# EAGLE schematic PianoBoard (EAGLE 9.6.2)
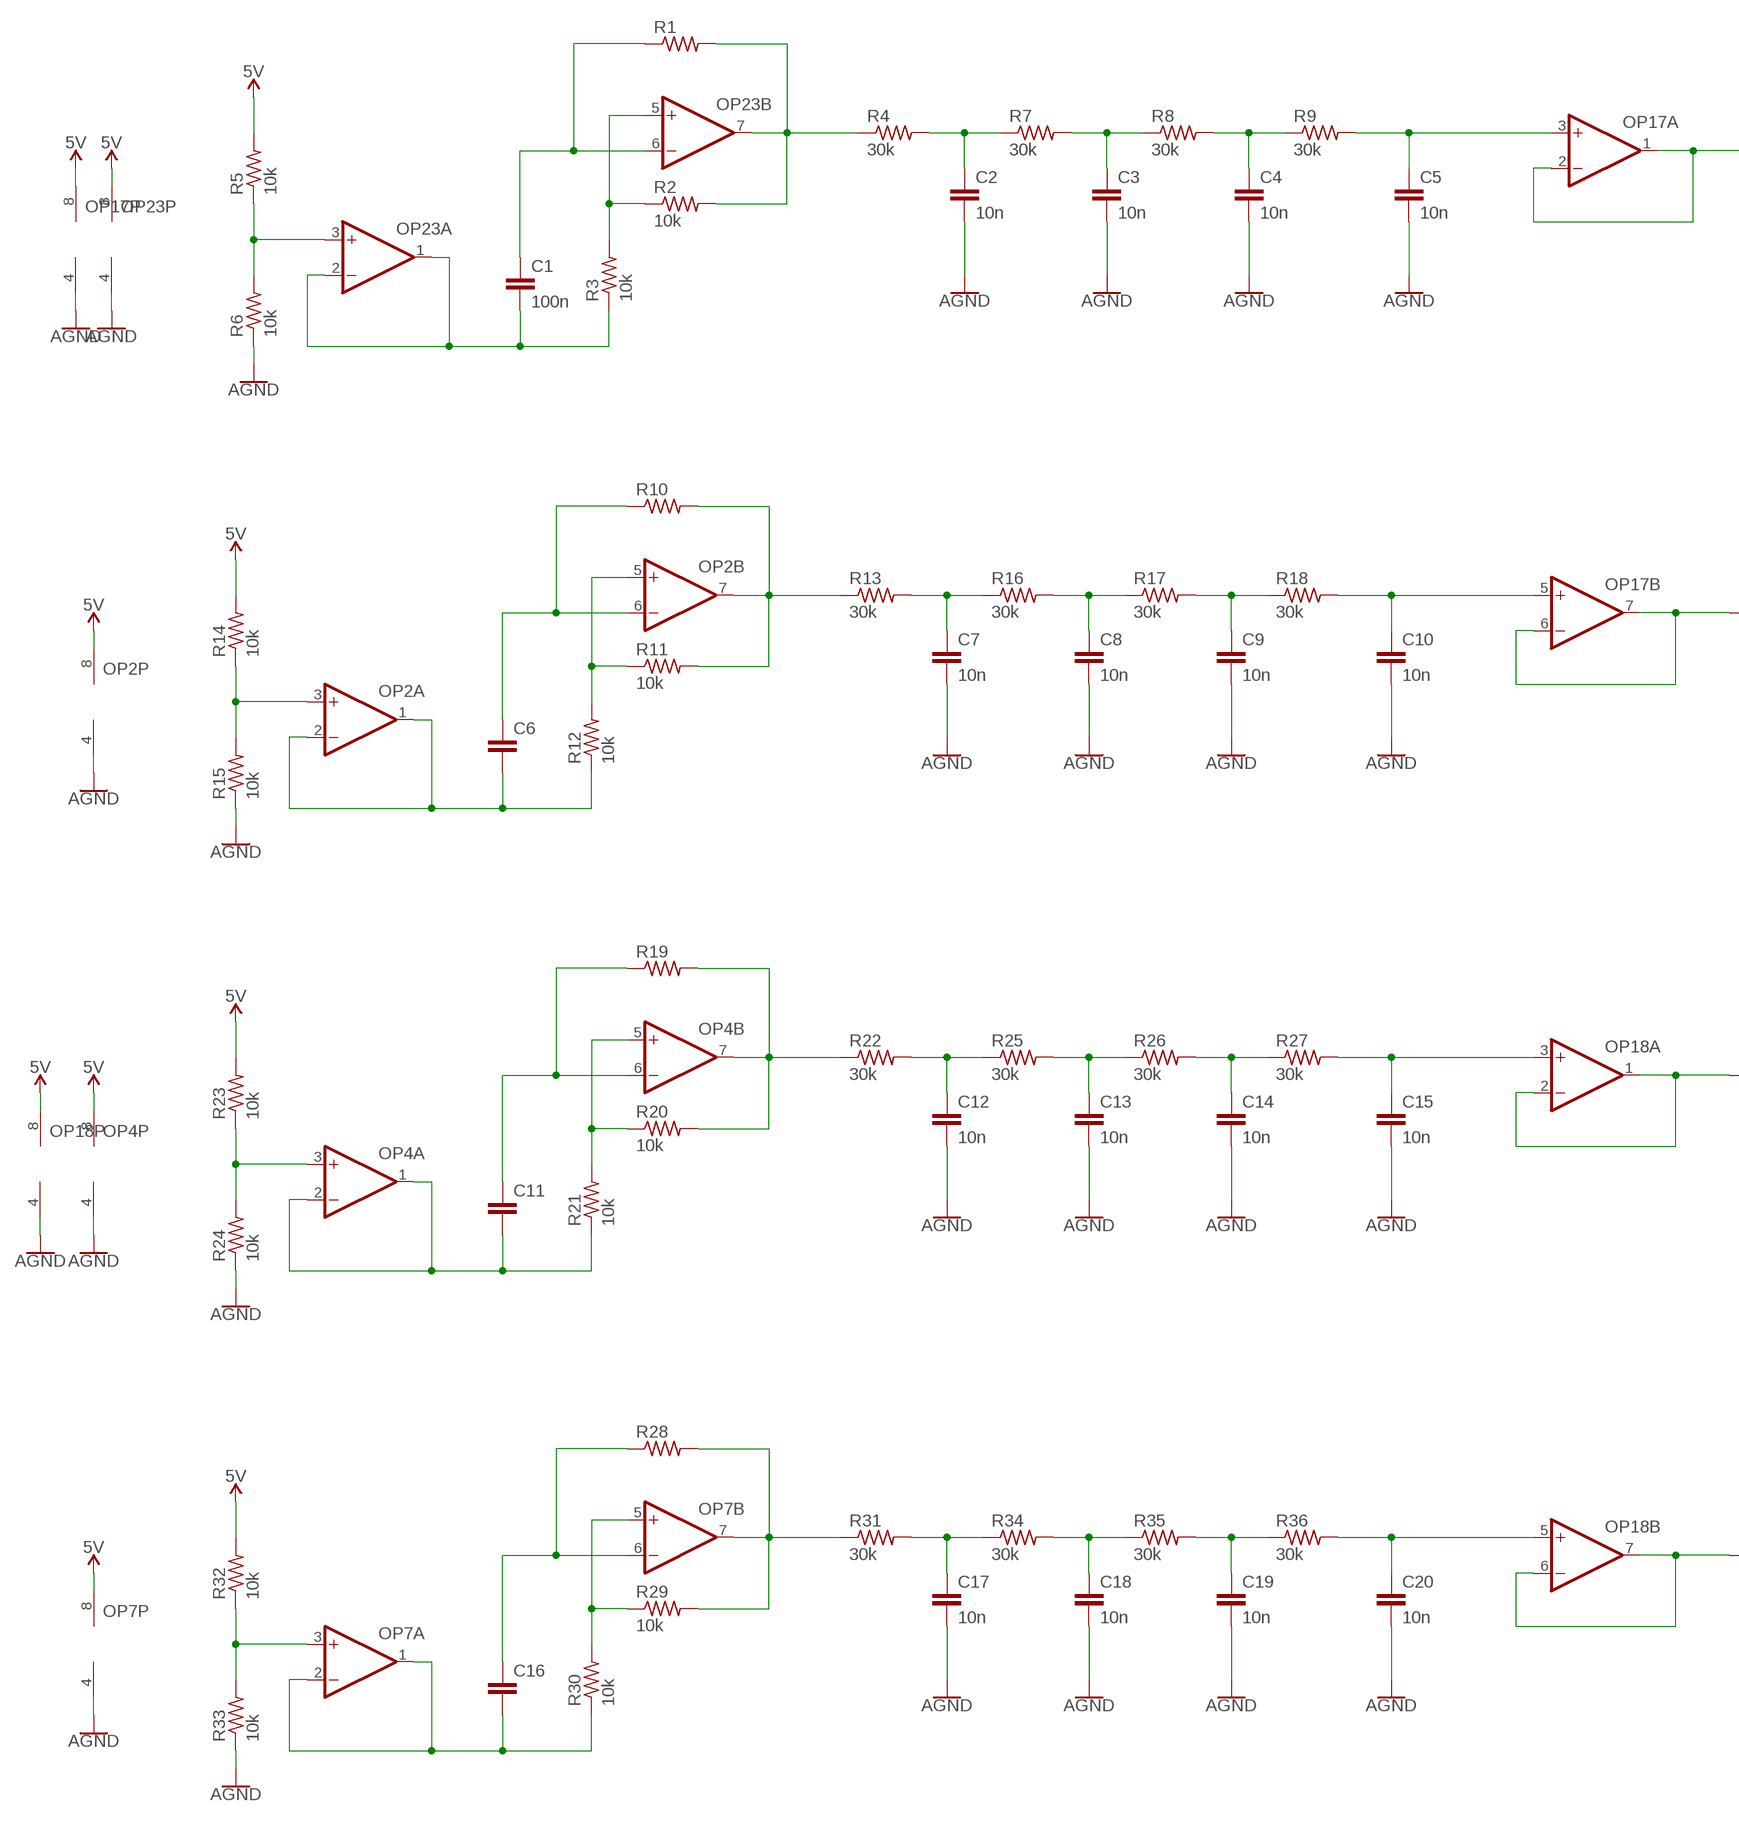
[diagram p0: schematic, sheet 1, part 1 of 2]
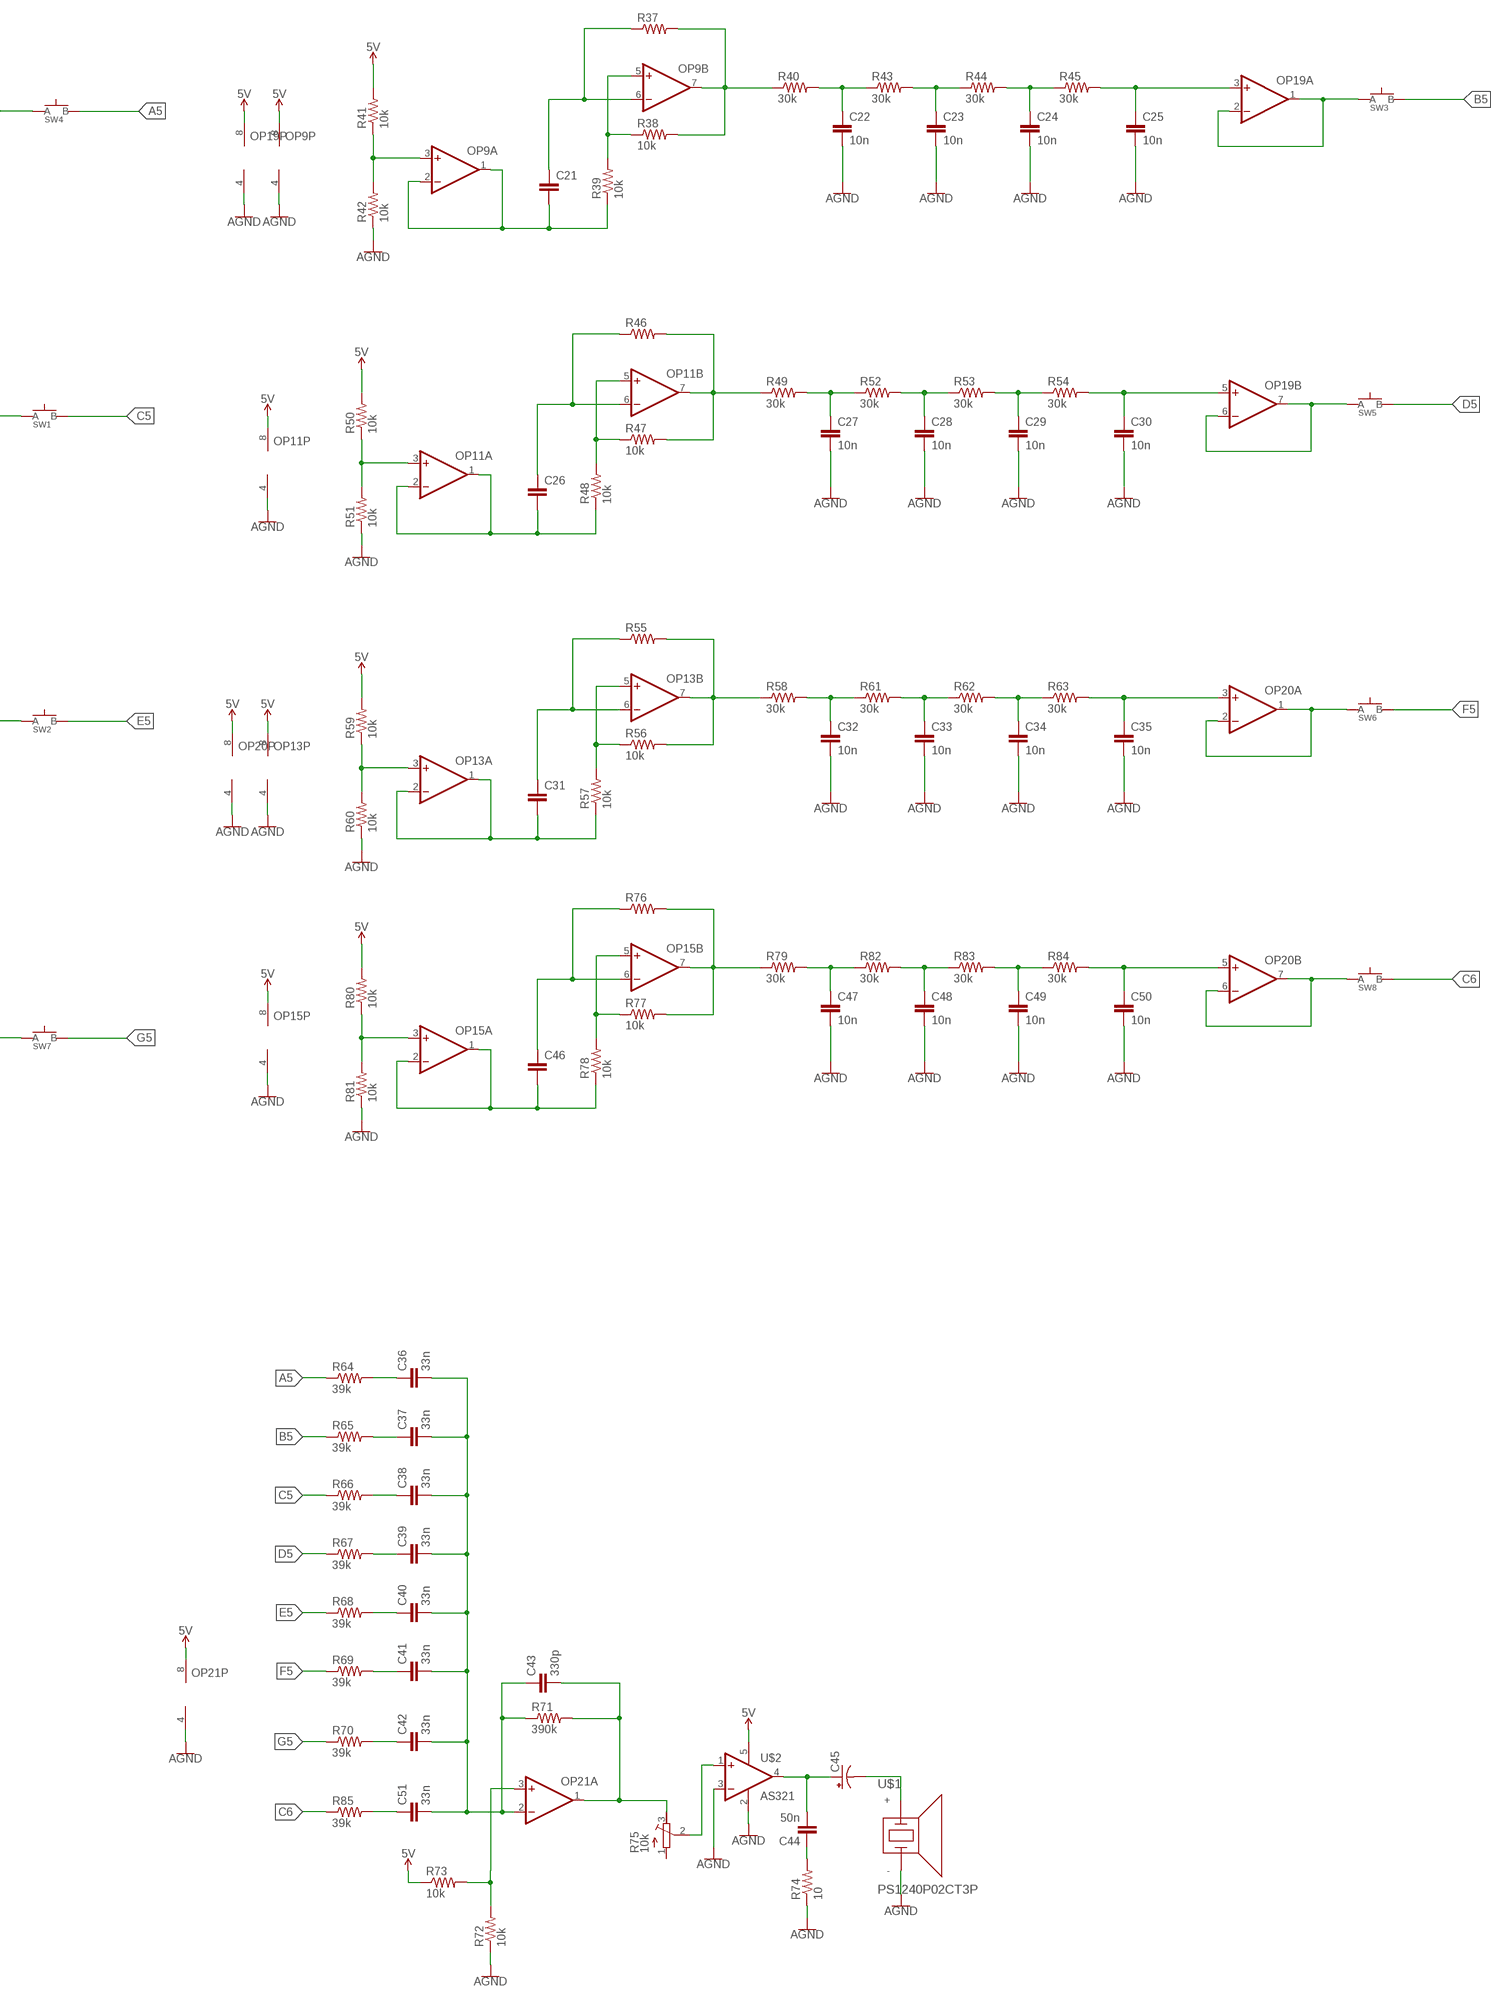
[diagram p1: schematic, sheet 1, part 2 of 2]

## Parts
C1  100n  CAPACITOR0603  [C0603]
C2  10n  CAPACITOR0603  [C0603]
C3  10n  CAPACITOR0603  [C0603]
C4  10n  CAPACITOR0603  [C0603]
C5  10n  CAPACITOR0603  [C0603]
C6  CAPACITOR0603  [C0603]
C7  10n  CAPACITOR0603  [C0603]
C8  10n  CAPACITOR0603  [C0603]
C9  10n  CAPACITOR0603  [C0603]
C10  10n  CAPACITOR0603  [C0603]
C11  CAPACITOR0603  [C0603]
C12  10n  CAPACITOR0603  [C0603]
C13  10n  CAPACITOR0603  [C0603]
C14  10n  CAPACITOR0603  [C0603]
C15  10n  CAPACITOR0603  [C0603]
C16  CAPACITOR0603  [C0603]
C17  10n  CAPACITOR0603  [C0603]
C18  10n  CAPACITOR0603  [C0603]
C19  10n  CAPACITOR0603  [C0603]
C20  10n  CAPACITOR0603  [C0603]
C21  CAPACITOR0603  [C0603]
C22  10n  CAPACITOR0603  [C0603]
C23  10n  CAPACITOR0603  [C0603]
C24  10n  CAPACITOR0603  [C0603]
C25  10n  CAPACITOR0603  [C0603]
C26  CAPACITOR0603  [C0603]
C27  10n  CAPACITOR0603  [C0603]
C28  10n  CAPACITOR0603  [C0603]
C29  10n  CAPACITOR0603  [C0603]
C30  10n  CAPACITOR0603  [C0603]
C31  CAPACITOR0603  [C0603]
C32  10n  CAPACITOR0603  [C0603]
C33  10n  CAPACITOR0603  [C0603]
C34  10n  CAPACITOR0603  [C0603]
C35  10n  CAPACITOR0603  [C0603]
C36  33n  CAPACITOR0603  [C0603]
C37  33n  CAPACITOR0603  [C0603]
C38  33n  CAPACITOR0603  [C0603]
C39  33n  CAPACITOR0603  [C0603]
C40  33n  CAPACITOR0603  [C0603]
C41  33n  CAPACITOR0603  [C0603]
C42  33n  CAPACITOR0603  [C0603]
C43  330p  CAPACITOR0603  [C0603]
C44  50n  CAPACITOR0603  [C0603]
C45  CAPACITOR.POLAR.0603  [C0603.POLAR]
C46  CAPACITOR0603  [C0603]
C47  10n  CAPACITOR0603  [C0603]
C48  10n  CAPACITOR0603  [C0603]
C49  10n  CAPACITOR0603  [C0603]
C50  10n  CAPACITOR0603  [C0603]
C51  33n  CAPACITOR0603  [C0603]
OP2  OP-DUALR  [SO8]
OP4  OP-DUALR  [SO8]
OP7  OP-DUALR  [SO8]
OP9  OP-DUALR  [SO8]
OP11  OP-DUALR  [SO8]
OP13  OP-DUALR  [SO8]
OP15  OP-DUALR  [SO8]
OP17  OP-DUALMCP6002R  [SO8]
OP18  OP-DUALMCP6002R  [SO8]
OP19  OP-DUALMCP6002R  [SO8]
OP20  OP-DUALMCP6002R  [SO8]
OP21  OP-DUALMCP6002R  [SO8]
OP23  OP-DUALR  [SO8]
R1  RESISTOR0603  [R0603]
R2  10k  RESISTOR0603  [R0603]
R3  10k  RESISTOR0603  [R0603]
R4  30k  RESISTOR0603  [R0603]
R5  10k  RESISTOR0603  [R0603]
R6  10k  RESISTOR0603  [R0603]
R7  30k  RESISTOR0603  [R0603]
R8  30k  RESISTOR0603  [R0603]
R9  30k  RESISTOR0603  [R0603]
R10  RESISTOR0603  [R0603]
R11  10k  RESISTOR0603  [R0603]
R12  10k  RESISTOR0603  [R0603]
R13  30k  RESISTOR0603  [R0603]
R14  10k  RESISTOR0603  [R0603]
R15  10k  RESISTOR0603  [R0603]
R16  30k  RESISTOR0603  [R0603]
R17  30k  RESISTOR0603  [R0603]
R18  30k  RESISTOR0603  [R0603]
R19  RESISTOR0603  [R0603]
R20  10k  RESISTOR0603  [R0603]
R21  10k  RESISTOR0603  [R0603]
R22  30k  RESISTOR0603  [R0603]
R23  10k  RESISTOR0603  [R0603]
R24  10k  RESISTOR0603  [R0603]
R25  30k  RESISTOR0603  [R0603]
R26  30k  RESISTOR0603  [R0603]
R27  30k  RESISTOR0603  [R0603]
R28  RESISTOR0603  [R0603]
R29  10k  RESISTOR0603  [R0603]
R30  10k  RESISTOR0603  [R0603]
R31  30k  RESISTOR0603  [R0603]
R32  10k  RESISTOR0603  [R0603]
R33  10k  RESISTOR0603  [R0603]
R34  30k  RESISTOR0603  [R0603]
R35  30k  RESISTOR0603  [R0603]
R36  30k  RESISTOR0603  [R0603]
R37  RESISTOR0603  [R0603]
R38  10k  RESISTOR0603  [R0603]
R39  10k  RESISTOR0603  [R0603]
R40  30k  RESISTOR0603  [R0603]
R41  10k  RESISTOR0603  [R0603]
R42  10k  RESISTOR0603  [R0603]
R43  30k  RESISTOR0603  [R0603]
R44  30k  RESISTOR0603  [R0603]
R45  30k  RESISTOR0603  [R0603]
R46  RESISTOR0603  [R0603]
R47  10k  RESISTOR0603  [R0603]
R48  10k  RESISTOR0603  [R0603]
R49  30k  RESISTOR0603  [R0603]
R50  10k  RESISTOR0603  [R0603]
R51  10k  RESISTOR0603  [R0603]
R52  30k  RESISTOR0603  [R0603]
R53  30k  RESISTOR0603  [R0603]
R54  30k  RESISTOR0603  [R0603]
R55  RESISTOR0603  [R0603]
R56  10k  RESISTOR0603  [R0603]
R57  10k  RESISTOR0603  [R0603]
R58  30k  RESISTOR0603  [R0603]
R59  10k  RESISTOR0603  [R0603]
R60  10k  RESISTOR0603  [R0603]
R61  30k  RESISTOR0603  [R0603]
R62  30k  RESISTOR0603  [R0603]
R63  30k  RESISTOR0603  [R0603]
R64  39k  RESISTOR0603  [R0603]
R65  39k  RESISTOR0603  [R0603]
R66  39k  RESISTOR0603  [R0603]
R67  39k  RESISTOR0603  [R0603]
R68  39k  RESISTOR0603  [R0603]
R69  39k  RESISTOR0603  [R0603]
R70  39k  RESISTOR0603  [R0603]
R71  390k  RESISTOR0603  [R0603]
R72  10k  RESISTOR0603  [R0603]
R73  10k  RESISTOR0603  [R0603]
R74  10  RESISTOR0603  [R0603]
R75  10k  TRIM-POT-P160  [16MMROTARYPOT]
R76  RESISTOR0603  [R0603]
R77  10k  RESISTOR0603  [R0603]
R78  10k  RESISTOR0603  [R0603]
R79  30k  RESISTOR0603  [R0603]
R80  10k  RESISTOR0603  [R0603]
R81  10k  RESISTOR0603  [R0603]
R82  30k  RESISTOR0603  [R0603]
R83  30k  RESISTOR0603  [R0603]
R84  30k  RESISTOR0603  [R0603]
R85  39k  RESISTOR0603  [R0603]
SW1  SPST.KT11P4SM34LFS  [SPST.KT11P4SM34LFS]
SW2  SPST.KT11P4SM34LFS  [SPST.KT11P4SM34LFS]
SW3  SPST.KT11P4SM34LFS  [SPST.KT11P4SM34LFS]
SW4  SPST.KT11P4SM34LFS  [SPST.KT11P4SM34LFS]
SW5  SPST.KT11P4SM34LFS  [SPST.KT11P4SM34LFS]
SW6  SPST.KT11P4SM34LFS  [SPST.KT11P4SM34LFS]
SW7  SPST.KT11P4SM34LFS  [SPST.KT11P4SM34LFS]
SW8  SPST.KT11P4SM34LFS  [SPST.KT11P4SM34LFS]
U$1  PS1240P02CT3P  [PIEZO-1]
U$2  AS321  [SOT23-5]

## Nets
5V: OP2.8(P:V+) OP4.8(P:V+) OP7.8(P:V+) OP9.8(P:V+) OP11.8(P:V+) OP13.8(P:V+) OP15.8(P:V+) OP17.8(P:V+) OP18.8(P:V+) OP19.8(P:V+) OP20.8(P:V+) OP21.8(P:V+) OP23.8(P:V+) R5.2 R14.2 R23.2 R32.2 R41.2 R50.2 R59.2 R73.1 R80.2 U$2.5(V+)
A5: R64.1 SW4.3(B) SW4.4(B)
AGND: C2.2 C3.2 C4.2 C5.2 C7.2 C8.2 C9.2 C10.2 C12.2 C13.2 C14.2 C15.2 C17.2 C18.2 C19.2 C20.2 C22.2 C23.2 C24.2 C25.2 C27.2 C28.2 C29.2 C30.2 C32.2 C33.2 C34.2 C35.2 C47.2 C48.2 C49.2 C50.2 OP2.4(P:V-) OP4.4(P:V-) OP7.4(P:V-) OP9.4(P:V-) OP11.4(P:V-) OP13.4(P:V-) OP15.4(P:V-) OP17.4(P:V-) OP18.4(P:V-) OP19.4(P:V-) OP20.4(P:V-) OP21.4(P:V-) OP23.4(P:V-) R6.1 R15.1 R24.1 R33.1 R42.1 R51.1 R60.1 R72.1 R74.1 R81.1 U$1.- U$2.2(V-) U$2.3(-IN)
B5: R65.1 SW3.3(B) SW3.4(B)
C5: R66.1 SW1.3(B) SW1.4(B)
C6: R85.1 SW8.3(B) SW8.4(B)
D5: R67.1 SW5.3(B) SW5.4(B)
E5: R68.1 SW2.3(B) SW2.4(B)
F5: R69.1 SW6.3(B) SW6.4(B)
G5: R70.1 SW7.3(B) SW7.4(B)
N$1: OP23.3(A:+IN) R5.1 R6.2
N$2: C1.2 OP23.1(A:OUT) OP23.2(A:-IN) R3.1
N$3: OP23.5(B:+IN) R2.1 R3.2
N$4: OP2.3(A:+IN) R14.1 R15.2
N$5: C2.1 R4.2 R7.1
N$6: OP23.7(B:OUT) R1.2 R2.2 R4.1
N$7: C3.1 R7.2 R8.1
N$8: C4.1 R8.2 R9.1
N$9: C5.1 OP17.3(A:+IN) R9.2
N$10: OP17.1(A:OUT) OP17.2(A:-IN) SW4.1(A) SW4.2(A)
N$11: C6.2 OP2.1(A:OUT) OP2.2(A:-IN) R12.1
N$12: OP2.5(B:+IN) R11.1 R12.2
N$13: OP2.7(B:OUT) R10.2 R11.2 R13.1
N$14: C7.1 R13.2 R16.1
N$15: C8.1 R16.2 R17.1
N$16: C9.1 R17.2 R18.1
N$17: C10.1 OP17.5(B:+IN) R18.2
N$18: OP17.6(B:-IN) OP17.7(B:OUT) SW1.1(A) SW1.2(A)
N$19: C6.1 OP2.6(B:-IN) R10.1
N$20: OP4.3(A:+IN) R23.1 R24.2
N$21: C11.2 OP4.1(A:OUT) OP4.2(A:-IN) R21.1
N$22: OP4.5(B:+IN) R20.1 R21.2
N$23: OP4.7(B:OUT) R19.2 R20.2 R22.1
N$24: C12.1 R22.2 R25.1
N$25: C13.1 R25.2 R26.1
N$26: C14.1 R26.2 R27.1
N$27: C15.1 OP18.3(A:+IN) R27.2
N$28: OP18.1(A:OUT) OP18.2(A:-IN) SW2.1(A) SW2.2(A)
N$29: C11.1 OP4.6(B:-IN) R19.1
N$30: OP7.3(A:+IN) R32.1 R33.2
N$31: C1.1 OP23.6(B:-IN) R1.1
N$32: C16.2 OP7.1(A:OUT) OP7.2(A:-IN) R30.1
N$33: OP7.5(B:+IN) R29.1 R30.2
N$34: OP7.7(B:OUT) R28.2 R29.2 R31.1
N$35: C17.1 R31.2 R34.1
N$36: C18.1 R34.2 R35.1
N$37: C19.1 R35.2 R36.1
N$38: C20.1 OP18.5(B:+IN) R36.2
N$39: OP18.6(B:-IN) OP18.7(B:OUT) SW7.1(A) SW7.2(A)
N$40: C16.1 OP7.6(B:-IN) R28.1
N$41: OP9.3(A:+IN) R41.1 R42.2
N$42: C21.2 OP9.1(A:OUT) OP9.2(A:-IN) R39.1
N$43: OP9.5(B:+IN) R38.1 R39.2
N$44: OP9.7(B:OUT) R37.2 R38.2 R40.1
N$45: C22.1 R40.2 R43.1
N$46: C23.1 R43.2 R44.1
N$47: C24.1 R44.2 R45.1
N$48: C25.1 OP19.3(A:+IN) R45.2
N$49: OP19.1(A:OUT) OP19.2(A:-IN) SW3.1(A) SW3.2(A)
N$50: C21.1 OP9.6(B:-IN) R37.1
N$51: OP11.3(A:+IN) R50.1 R51.2
N$52: C26.2 OP11.1(A:OUT) OP11.2(A:-IN) R48.1
N$53: OP11.5(B:+IN) R47.1 R48.2
N$54: OP11.7(B:OUT) R46.2 R47.2 R49.1
N$55: C27.1 R49.2 R52.1
N$56: C28.1 R52.2 R53.1
N$57: C29.1 R53.2 R54.1
N$58: C30.1 OP19.5(B:+IN) R54.2
N$59: OP19.6(B:-IN) OP19.7(B:OUT) SW5.1(A) SW5.2(A)
N$60: C26.1 OP11.6(B:-IN) R46.1
N$61: OP13.3(A:+IN) R59.1 R60.2
N$62: C31.2 OP13.1(A:OUT) OP13.2(A:-IN) R57.1
N$63: OP13.5(B:+IN) R56.1 R57.2
N$64: OP13.7(B:OUT) R55.2 R56.2 R58.1
N$65: C32.1 R58.2 R61.1
N$66: C33.1 R61.2 R62.1
N$67: C34.1 R62.2 R63.1
N$68: C35.1 OP20.3(A:+IN) R63.2
N$69: OP20.1(A:OUT) OP20.2(A:-IN) SW6.1(A) SW6.2(A)
N$70: C31.1 OP13.6(B:-IN) R55.1
N$71: C36.1 R64.2
N$72: C37.1 R65.2
N$73: C38.1 R66.2
N$74: C39.1 R67.2
N$75: C40.1 R68.2
N$76: C41.1 R69.2
N$77: C42.1 R70.2
N$79: C43.2 OP21.1(A:OUT) R71.2 R75.3(E)
N$80: OP21.3(A:+IN)
N$81: R72.2 R73.2
N$82: R75.2(S) U$2.1(+IN)
N$83: C44.2 C45.A(+) U$2.4(OUT)
N$84: C44.1 R74.2
N$85: C45.C(-) U$1.+
N$86: OP15.3(A:+IN) R80.1 R81.2
N$87: C46.2 OP15.1(A:OUT) OP15.2(A:-IN) R78.1
N$88: OP15.5(B:+IN) R77.1 R78.2
N$89: OP15.7(B:OUT) R76.2 R77.2 R79.1
N$90: C47.1 R79.2 R82.1
N$91: C48.1 R82.2 R83.1
N$92: C49.1 R83.2 R84.1
N$93: C50.1 OP20.5(B:+IN) R84.2
N$94: OP20.6(B:-IN) OP20.7(B:OUT) SW8.1(A) SW8.2(A)
N$95: C46.1 OP15.6(B:-IN) R76.1
N$96: C51.1 R85.2
N$98: C36.2 C37.2 C38.2 C39.2 C40.2 C41.2 C42.2 C43.1 C51.2 OP21.2(A:-IN) R71.1
Unconnected: OP21.5(B:+IN) OP21.6(B:-IN) OP21.7(B:OUT) R75.1(A)

## Library data of the parts
C1-C44 C46-C51 = LinnesLab-Passives:CAPACITOR
C45 = LinnesLab-Passives:CAPACITOR.POLAR
OP2 OP4 OP7 OP9 OP11 OP13 OP15 OP23 = LinnesLab-AnalogIC:OP-DUAL: Precision Micropower, Low Noise CMOS, Rail-to-Rail Input/Output Operational Amplifiers Source: http://www.analog.com/static/imported-files/data_sheets/AD8603_8607_8609.pdf; MPN: AD8607ARMZ-R2; OC_FARNELL: 1651293; OC_NEWARK: 19M8927
OP17-OP21 = LinnesLab-AnalogIC:OP-DUAL: Precision Micropower, Low Noise CMOS, Rail-to-Rail Input/Output Operational Amplifiers Source: http://www.analog.com/static/imported-files/data_sheets/AD8603_8607_8609.pdf; DIGIKEY: MCP6002T-I/SNCT-ND; MF: Microchip Technology; MPN: MCP6002T-I/SN
R1-R74 R76-R85 = LinnesLab-Passives:RESISTOR
R75 = LinnesLab-Passives:TRIM-POT-P160
SW1-SW8 = LinnesLab-Switches:SPST.KT11P4SM34LFS: https://www.ckswitches.com/media/1468/kt.pdf
U$1 = LinnesLab-Electromechanical:PS1240P02CT3
U$2 = LinnesLab-AnalogIC:AS321